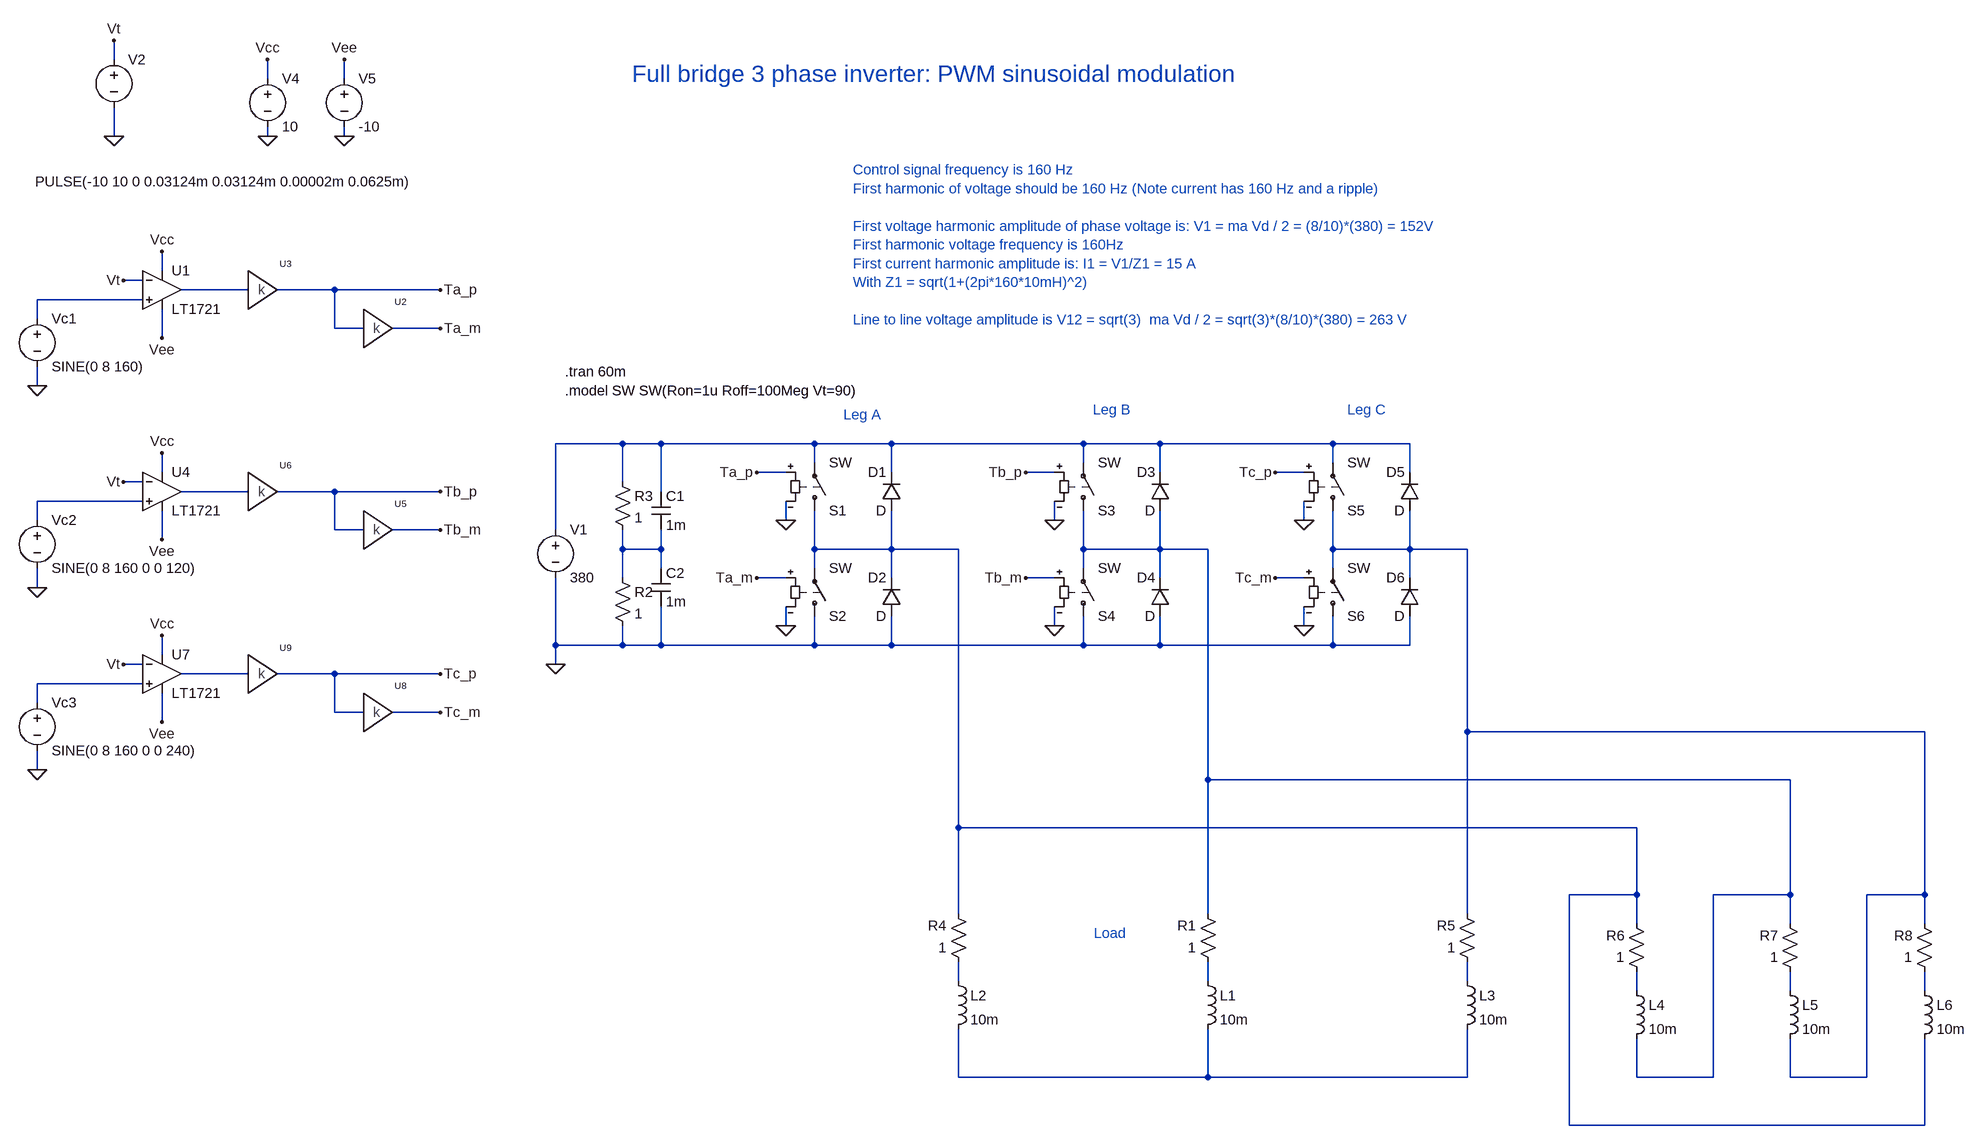
[diagram p0: schematic Three-phase-full-bridge-inverter.asc]
Three-phase-full-bridge-inverter.asc, the LTspice schematic file:
Version 4.1
SHEET 1 2456 1188
WIRE -736 -592 -736 -624
WIRE -480 -560 -480 -592
WIRE -352 -560 -352 -592
WIRE -736 -464 -736 -512
WIRE -480 -464 -480 -480
WIRE -352 -464 -352 -480
WIRE -656 -240 -656 -272
WIRE -688 -224 -720 -224
WIRE -512 -208 -624 -208
WIRE -368 -208 -464 -208
WIRE -192 -208 -368 -208
WIRE -688 -192 -864 -192
WIRE -864 -160 -864 -192
WIRE -368 -144 -368 -208
WIRE -320 -144 -368 -144
WIRE -192 -144 -272 -144
WIRE -656 -128 -656 -176
WIRE -864 -48 -864 -80
WIRE 112 48 0 48
WIRE 176 48 112 48
WIRE 432 48 176 48
WIRE 560 48 432 48
WIRE 880 48 560 48
WIRE 1008 48 880 48
WIRE 1296 48 1008 48
WIRE 1424 48 1296 48
WIRE 432 80 432 48
WIRE 880 80 880 48
WIRE 1296 80 1296 48
WIRE -656 96 -656 64
WIRE 384 96 336 96
WIRE 560 96 560 48
WIRE 832 96 784 96
WIRE 1008 96 1008 48
WIRE 1248 96 1200 96
WIRE 1424 96 1424 48
WIRE -688 112 -720 112
WIRE 112 112 112 48
WIRE -512 128 -624 128
WIRE -368 128 -464 128
WIRE -192 128 -368 128
WIRE 176 128 176 48
WIRE -688 144 -864 144
WIRE -864 176 -864 144
WIRE 384 176 384 144
WIRE 832 176 832 144
WIRE 1248 176 1248 144
WIRE -368 192 -368 128
WIRE -320 192 -368 192
WIRE -192 192 -272 192
WIRE 0 192 0 48
WIRE -656 208 -656 160
WIRE 112 224 112 192
WIRE 176 224 176 192
WIRE 176 224 112 224
WIRE 432 224 432 160
WIRE 560 224 560 160
WIRE 560 224 432 224
WIRE 672 224 560 224
WIRE 880 224 880 160
WIRE 1008 224 1008 160
WIRE 1008 224 880 224
WIRE 1088 224 1008 224
WIRE 1296 224 1296 160
WIRE 1424 224 1424 160
WIRE 1424 224 1296 224
WIRE 1520 224 1424 224
WIRE 176 256 176 224
WIRE 432 256 432 224
WIRE 880 256 880 224
WIRE 1296 256 1296 224
WIRE 112 272 112 224
WIRE 384 272 336 272
WIRE 560 272 560 224
WIRE 832 272 784 272
WIRE 1008 272 1008 224
WIRE 1248 272 1200 272
WIRE 1424 272 1424 224
WIRE -864 288 -864 256
WIRE 384 352 384 320
WIRE 832 352 832 320
WIRE 1248 352 1248 320
WIRE 0 384 0 272
WIRE 112 384 112 352
WIRE 112 384 0 384
WIRE 176 384 176 320
WIRE 176 384 112 384
WIRE 432 384 432 336
WIRE 432 384 176 384
WIRE 560 384 560 336
WIRE 560 384 432 384
WIRE 880 384 880 336
WIRE 880 384 560 384
WIRE 1008 384 1008 336
WIRE 1008 384 880 384
WIRE 1296 384 1296 336
WIRE 1296 384 1008 384
WIRE 1424 384 1424 336
WIRE 1424 384 1296 384
WIRE -656 400 -656 368
WIRE -688 416 -720 416
WIRE 0 416 0 384
WIRE -512 432 -624 432
WIRE -368 432 -464 432
WIRE -192 432 -368 432
WIRE -688 448 -864 448
WIRE -864 480 -864 448
WIRE -368 496 -368 432
WIRE -320 496 -368 496
WIRE -192 496 -272 496
WIRE -656 512 -656 464
WIRE 1520 528 1520 224
WIRE 2384 528 1520 528
WIRE -864 592 -864 560
WIRE 1088 608 1088 224
WIRE 2160 608 1088 608
WIRE 672 688 672 224
WIRE 1904 688 672 688
WIRE 1904 800 1904 688
WIRE 1904 800 1792 800
WIRE 2160 800 2160 608
WIRE 2160 800 2032 800
WIRE 2384 800 2384 528
WIRE 2384 800 2288 800
WIRE 672 832 672 688
WIRE 1088 832 1088 608
WIRE 1520 832 1520 528
WIRE 1904 848 1904 800
WIRE 2160 848 2160 800
WIRE 2384 848 2384 800
WIRE 672 944 672 912
WIRE 1088 944 1088 912
WIRE 1520 944 1520 912
WIRE 1904 960 1904 928
WIRE 2160 960 2160 928
WIRE 2384 960 2384 928
WIRE 672 1104 672 1024
WIRE 1088 1104 1088 1024
WIRE 1088 1104 672 1104
WIRE 1520 1104 1520 1024
WIRE 1520 1104 1088 1104
WIRE 1904 1104 1904 1040
WIRE 2032 1104 2032 800
WIRE 2032 1104 1904 1104
WIRE 2160 1104 2160 1040
WIRE 2288 1104 2288 800
WIRE 2288 1104 2160 1104
WIRE 1792 1184 1792 800
WIRE 2384 1184 2384 1040
WIRE 2384 1184 1792 1184
FLAG 384 176 0
FLAG 384 352 0
FLAG 0 416 0
FLAG -480 -464 0
FLAG -352 -464 0
FLAG -864 -48 0
FLAG -736 -464 0
FLAG 832 176 0
FLAG 832 352 0
FLAG 1248 176 0
FLAG 1248 352 0
FLAG -192 -208 Ta_p
FLAG 336 96 Ta_p
FLAG -192 -144 Ta_m
FLAG 336 272 Ta_m
FLAG -480 -592 Vcc
FLAG -656 -272 Vcc
FLAG -656 -128 Vee
FLAG -352 -592 Vee
FLAG -736 -624 Vt
FLAG -720 -224 Vt
FLAG -864 288 0
FLAG -192 128 Tb_p
FLAG -192 192 Tb_m
FLAG -656 64 Vcc
FLAG -656 208 Vee
FLAG -720 112 Vt
FLAG -864 592 0
FLAG -192 432 Tc_p
FLAG -192 496 Tc_m
FLAG -656 368 Vcc
FLAG -656 512 Vee
FLAG -720 416 Vt
FLAG 784 96 Tb_p
FLAG 784 272 Tb_m
FLAG 1200 96 Tc_p
FLAG 1200 272 Tc_m
SYMBOL voltage 0 176 R0
WINDOW 123 0 0 Left 0
WINDOW 39 0 0 Left 0
SYMATTR InstName V1
SYMATTR Value 380
SYMBOL cap 160 128 R0
SYMATTR InstName C1
SYMATTR Value 1m
SYMATTR SpiceLine Rser=1m Rpar=1Meg
SYMBOL cap 160 256 R0
SYMATTR InstName C2
SYMATTR Value 1m
SYMATTR SpiceLine Rser=1m Rpar=1Meg
SYMBOL res 1104 928 R180
WINDOW 0 36 76 Left 2
WINDOW 3 36 40 Left 2
SYMATTR InstName R1
SYMATTR Value 1
SYMBOL ind 1072 928 R0
SYMATTR InstName L1
SYMATTR Value 10m
SYMBOL sw 432 176 M180
SYMATTR InstName S1
SYMBOL diode 576 160 R180
WINDOW 0 24 64 Left 2
WINDOW 3 24 0 Left 2
SYMATTR InstName D1
SYMBOL sw 432 352 M180
SYMATTR InstName S2
SYMBOL diode 576 336 R180
WINDOW 0 24 64 Left 2
WINDOW 3 24 0 Left 2
SYMATTR InstName D2
SYMBOL voltage -864 -176 R0
WINDOW 123 0 0 Left 0
WINDOW 39 0 0 Left 0
SYMATTR InstName Vc1
SYMATTR Value SINE(0 8 160)
SYMBOL Comparators\\LT1721 -656 -272 R0
SYMATTR InstName U1
SYMBOL voltage -480 -576 R0
WINDOW 123 0 0 Left 0
WINDOW 39 0 0 Left 0
SYMATTR InstName V4
SYMATTR Value 10
SYMBOL voltage -352 -576 R0
WINDOW 123 0 0 Left 0
WINDOW 39 0 0 Left 0
SYMATTR InstName V5
SYMATTR Value -10
SYMBOL Gain -304 -144 R0
SYMATTR InstName U2
SYMBOL voltage -736 -608 R0
WINDOW 3 -131 220 Left 2
WINDOW 123 0 0 Left 0
WINDOW 39 0 0 Left 0
SYMATTR Value PULSE(-10 10 0 0.03124m 0.03124m 0.00002m 0.0625m)
SYMATTR InstName V2
SYMBOL Gain -496 -208 R0
SYMATTR SpiceLine G=100
SYMATTR InstName U3
SYMBOL res 96 256 R0
SYMATTR InstName R2
SYMATTR Value 1
SYMBOL res 96 96 R0
SYMATTR InstName R3
SYMATTR Value 1
SYMBOL sw 880 176 M180
SYMATTR InstName S3
SYMBOL diode 1024 160 R180
WINDOW 0 24 64 Left 2
WINDOW 3 24 0 Left 2
SYMATTR InstName D3
SYMBOL sw 880 352 M180
SYMATTR InstName S4
SYMBOL diode 1024 336 R180
WINDOW 0 24 64 Left 2
WINDOW 3 24 0 Left 2
SYMATTR InstName D4
SYMBOL sw 1296 176 M180
SYMATTR InstName S5
SYMBOL diode 1440 160 R180
WINDOW 0 24 64 Left 2
WINDOW 3 24 0 Left 2
SYMATTR InstName D5
SYMBOL sw 1296 352 M180
SYMATTR InstName S6
SYMBOL diode 1440 336 R180
WINDOW 0 24 64 Left 2
WINDOW 3 24 0 Left 2
SYMATTR InstName D6
SYMBOL voltage -864 160 R0
WINDOW 123 0 0 Left 0
WINDOW 39 0 0 Left 0
SYMATTR InstName Vc2
SYMATTR Value SINE(0 8 160 0 0 120)
SYMBOL Comparators\\LT1721 -656 64 R0
SYMATTR InstName U4
SYMBOL Gain -304 192 R0
SYMATTR InstName U5
SYMBOL Gain -496 128 R0
SYMATTR SpiceLine G=100
SYMATTR InstName U6
SYMBOL voltage -864 464 R0
WINDOW 123 0 0 Left 0
WINDOW 39 0 0 Left 0
SYMATTR InstName Vc3
SYMATTR Value SINE(0 8 160 0 0 240)
SYMBOL Comparators\\LT1721 -656 368 R0
SYMATTR InstName U7
SYMBOL Gain -304 496 R0
SYMATTR InstName U8
SYMBOL Gain -496 432 R0
SYMATTR SpiceLine G=100
SYMATTR InstName U9
SYMBOL res 688 928 R180
WINDOW 0 36 76 Left 2
WINDOW 3 36 40 Left 2
SYMATTR InstName R4
SYMATTR Value 1
SYMBOL ind 656 928 R0
SYMATTR InstName L2
SYMATTR Value 10m
SYMBOL res 1536 928 R180
WINDOW 0 36 76 Left 2
WINDOW 3 36 40 Left 2
SYMATTR InstName R5
SYMATTR Value 1
SYMBOL ind 1504 928 R0
SYMATTR InstName L3
SYMATTR Value 10m
SYMBOL res 1920 944 R180
WINDOW 0 36 76 Left 2
WINDOW 3 36 40 Left 2
SYMATTR InstName R6
SYMATTR Value 1
SYMBOL ind 1888 944 R0
SYMATTR InstName L4
SYMATTR Value 10m
SYMBOL res 2176 944 R180
WINDOW 0 36 76 Left 2
WINDOW 3 36 40 Left 2
SYMATTR InstName R7
SYMATTR Value 1
SYMBOL ind 2144 944 R0
SYMATTR InstName L5
SYMATTR Value 10m
SYMBOL res 2400 944 R180
WINDOW 0 36 76 Left 2
WINDOW 3 36 40 Left 2
SYMATTR InstName R8
SYMATTR Value 1
SYMBOL ind 2368 944 R0
SYMATTR InstName L6
SYMATTR Value 10m
TEXT 16 -40 Left 2 !.model SW SW(Ron=1u Roff=100Meg Vt=90)
TEXT 16 -72 Left 2 !.tran 60m
TEXT 496 -408 Left 2 ;Control signal frequency is 160 Hz\nFirst harmonic of voltage should be 160 Hz (Note current has 160 Hz and a ripple)\n \nFirst voltage harmonic amplitude of phase voltage is: V1 = ma Vd / 2 = (8/10)*(380) = 152V\nFirst harmonic voltage frequency is 160Hz\nFirst current harmonic amplitude is: I1 = V1/Z1 = 15 A\nWith Z1 = sqrt(1+(2pi*160*10mH)^2)\n \nLine to line voltage amplitude is V12 = sqrt(3)  ma Vd / 2 = sqrt(3)*(8/10)*(380) = 263 V
TEXT 952 864 Right 2 ;Load
TEXT 480 0 Left 2 ;Leg A
TEXT 896 -8 Left 2 ;Leg B
TEXT 1320 -8 Left 2 ;Leg C
TEXT 128 -568 Left 4 ;Full bridge 3 phase inverter: PWM sinusoidal modulation

The netlist it stands for:
* Three-phase-full-bridge-inverter.asc
V1 N003 0 380
C1 N003 N006 1m Rser=1m Rpar=1Meg
C2 N006 0 1m Rser=1m Rpar=1Meg
R1 N013 N008 1
L1 N013 N018 10m
S1 N007 N003 Ta_p 0 SW
D1 N007 N003 D
S2 0 N007 Ta_m 0 SW
D2 0 N007 D
Vc1 N002 0 SINE(0 8 160)
X§U1 N002 Vt Vcc Vee N001 LT1720  ; LT1721, pins In+ In- V+ V- OUT
V4 Vcc 0 10
V5 Vee 0 -10
E§U2 Ta_p Ta_m G={G}
V2 Vt 0 PULSE(-10 10 0 0.03124m 0.03124m 0.00002m 0.0625m)
E§U3 N001 Ta_p G={G} G=100
R2 N006 0 1
R3 N003 N006 1
S3 N008 N003 Tb_p 0 SW
D3 N008 N003 D
S4 0 N008 Tb_m 0 SW
D4 0 N008 D
S5 N009 N003 Tc_p 0 SW
D5 N009 N003 D
S6 0 N009 Tc_m 0 SW
D6 0 N009 D
Vc2 N005 0 SINE(0 8 160 0 0 120)
X§U4 N005 Vt Vcc Vee N004 LT1720  ; LT1721, pins In+ In- V+ V- OUT
E§U5 Tb_p Tb_m G={G}
E§U6 N004 Tb_p G={G} G=100
Vc3 N011 0 SINE(0 8 160 0 0 240)
X§U7 N011 Vt Vcc Vee N010 LT1720  ; LT1721, pins In+ In- V+ V- OUT
E§U8 Tc_p Tc_m G={G}
E§U9 N010 Tc_p G={G} G=100
R4 N012 N007 1
L2 N012 N018 10m
R5 N014 N009 1
L3 N014 N018 10m
R6 N015 N007 1
L4 N015 N008 10m
R7 N016 N008 1
L5 N016 N009 10m
R8 N017 N009 1
L6 N017 N007 10m
.model D D
.lib standard.dio
.model SW SW(Ron=1u Roff=100Meg Vt=90)
.tran 60m
* Control signal frequency is 160 Hz
* First harmonic of voltage should be 160 Hz (Note current has 160 Hz and a ripple)
* First voltage harmonic amplitude of phase voltage is: V1 = ma Vd / 2 = (8/10)*(380) = 152V
* First harmonic voltage frequency is 160Hz
* First current harmonic amplitude is: I1 = V1/Z1 = 15 A
* With Z1 = sqrt(1+(2pi*160*10mH)^2)
* Line to line voltage amplitude is V12 = sqrt(3)  ma Vd / 2 = sqrt(3)*(8/10)*(380) = 263 V
* Load
* Leg A
* Leg B
* Leg C
* Full bridge 3 phase inverter: PWM sinusoidal modulation
.lib LTC.lib
.backanno
.end